# EAGLE board hdmi (EAGLE 6.5.0)
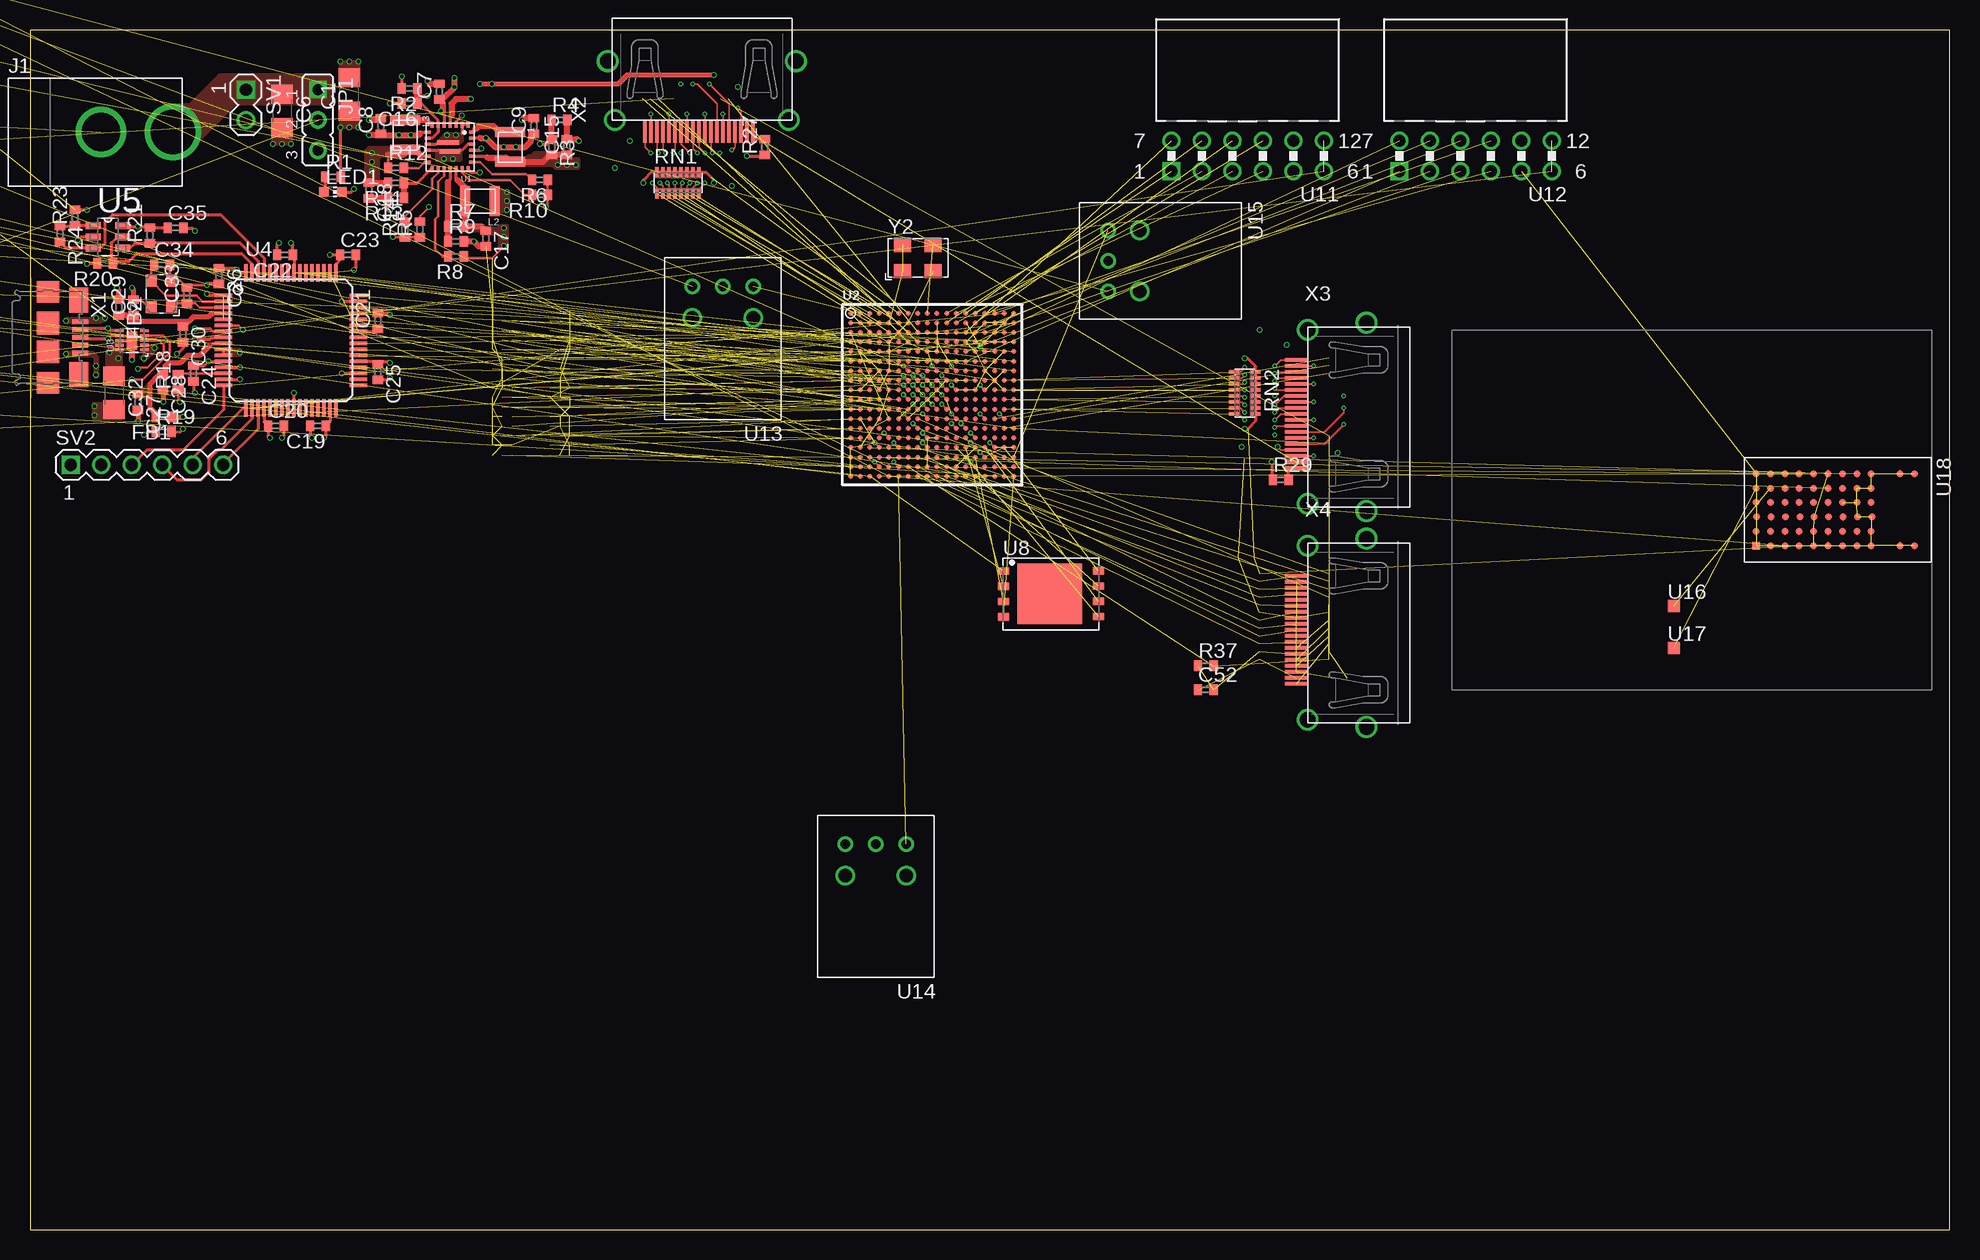
[diagram p9: board, top side]
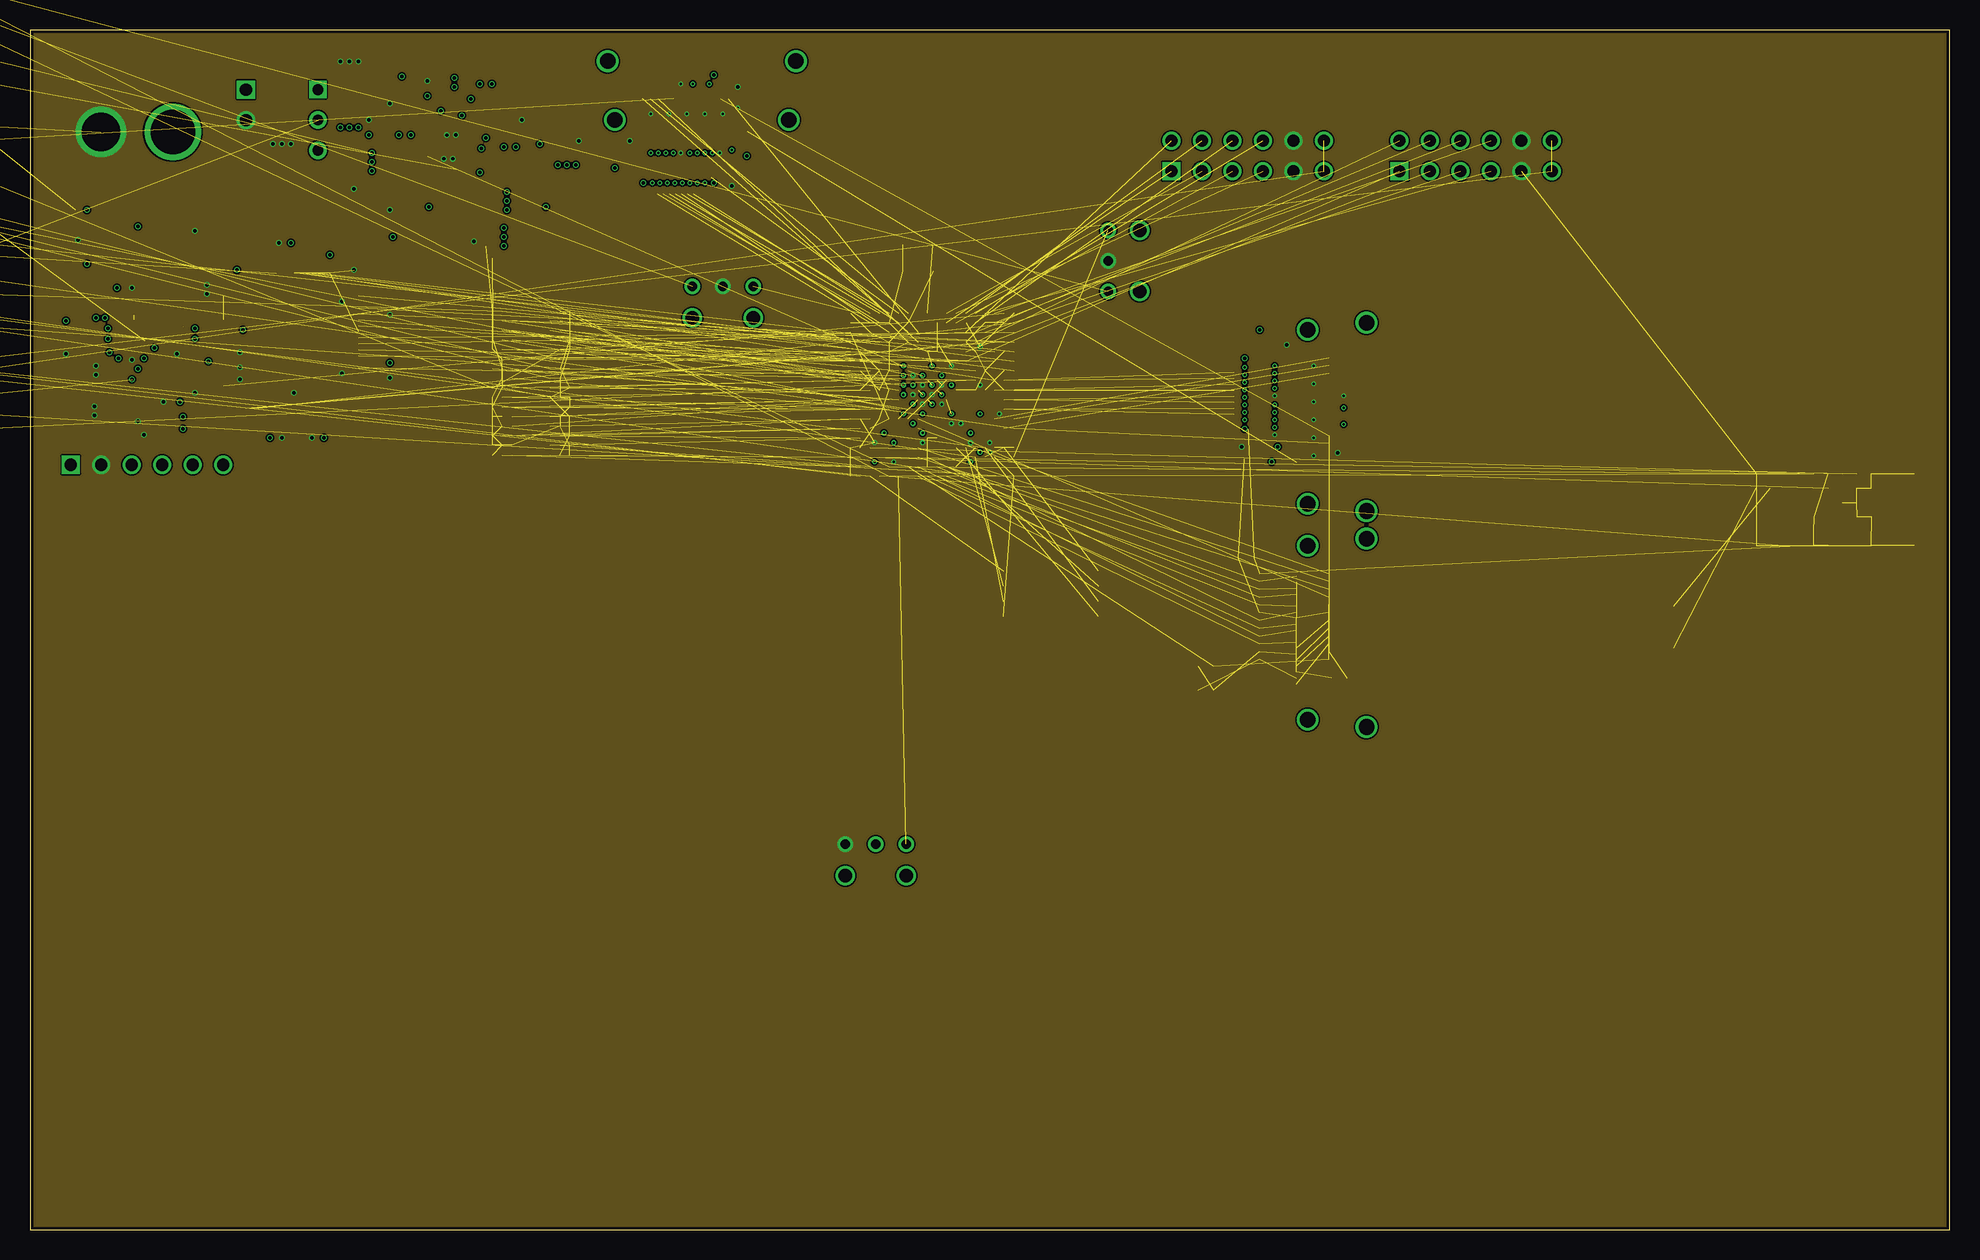
[diagram p10: board, inner layer Ground]
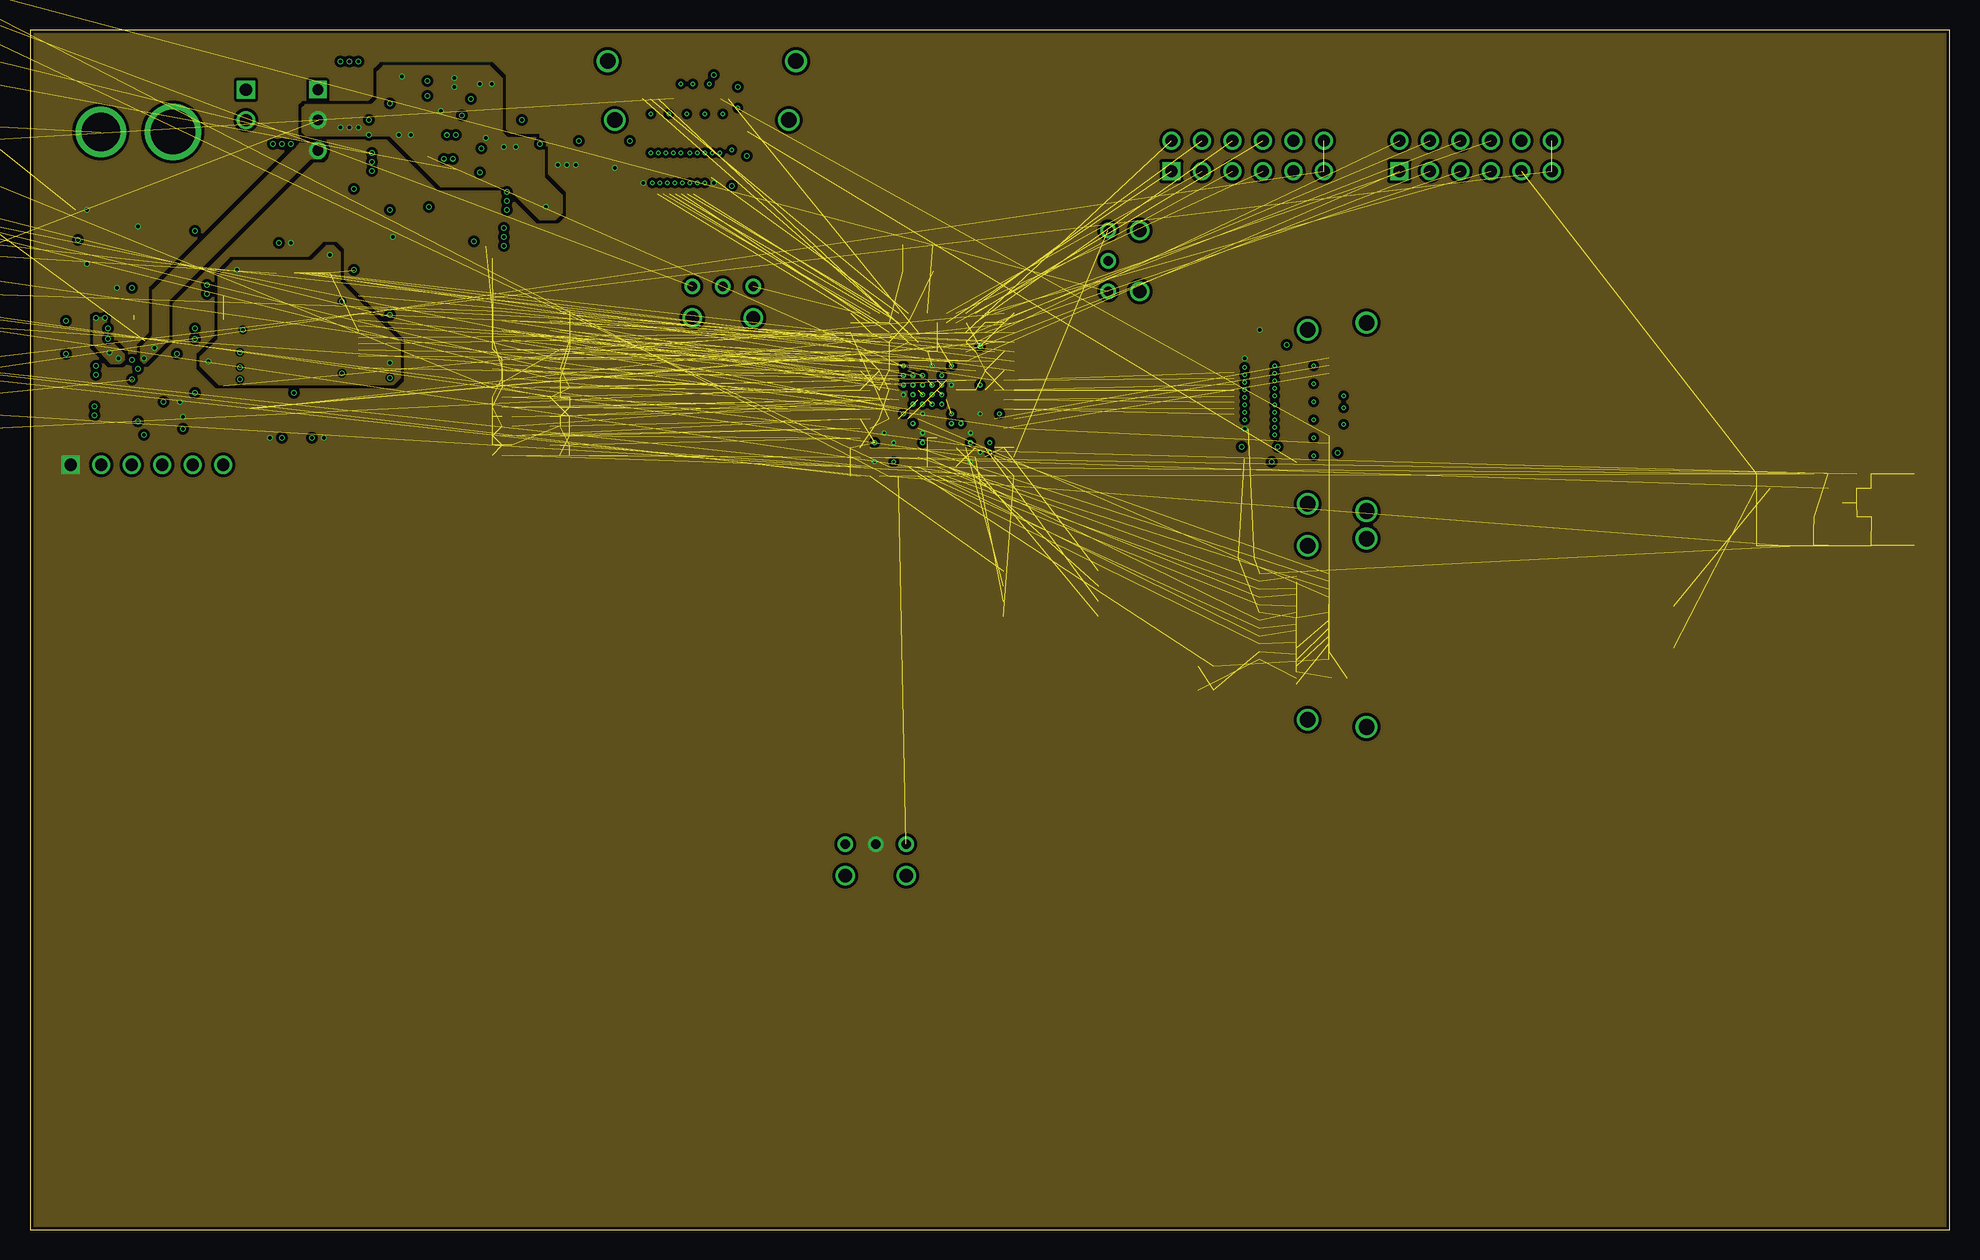
[diagram p11: board, inner layer Power]
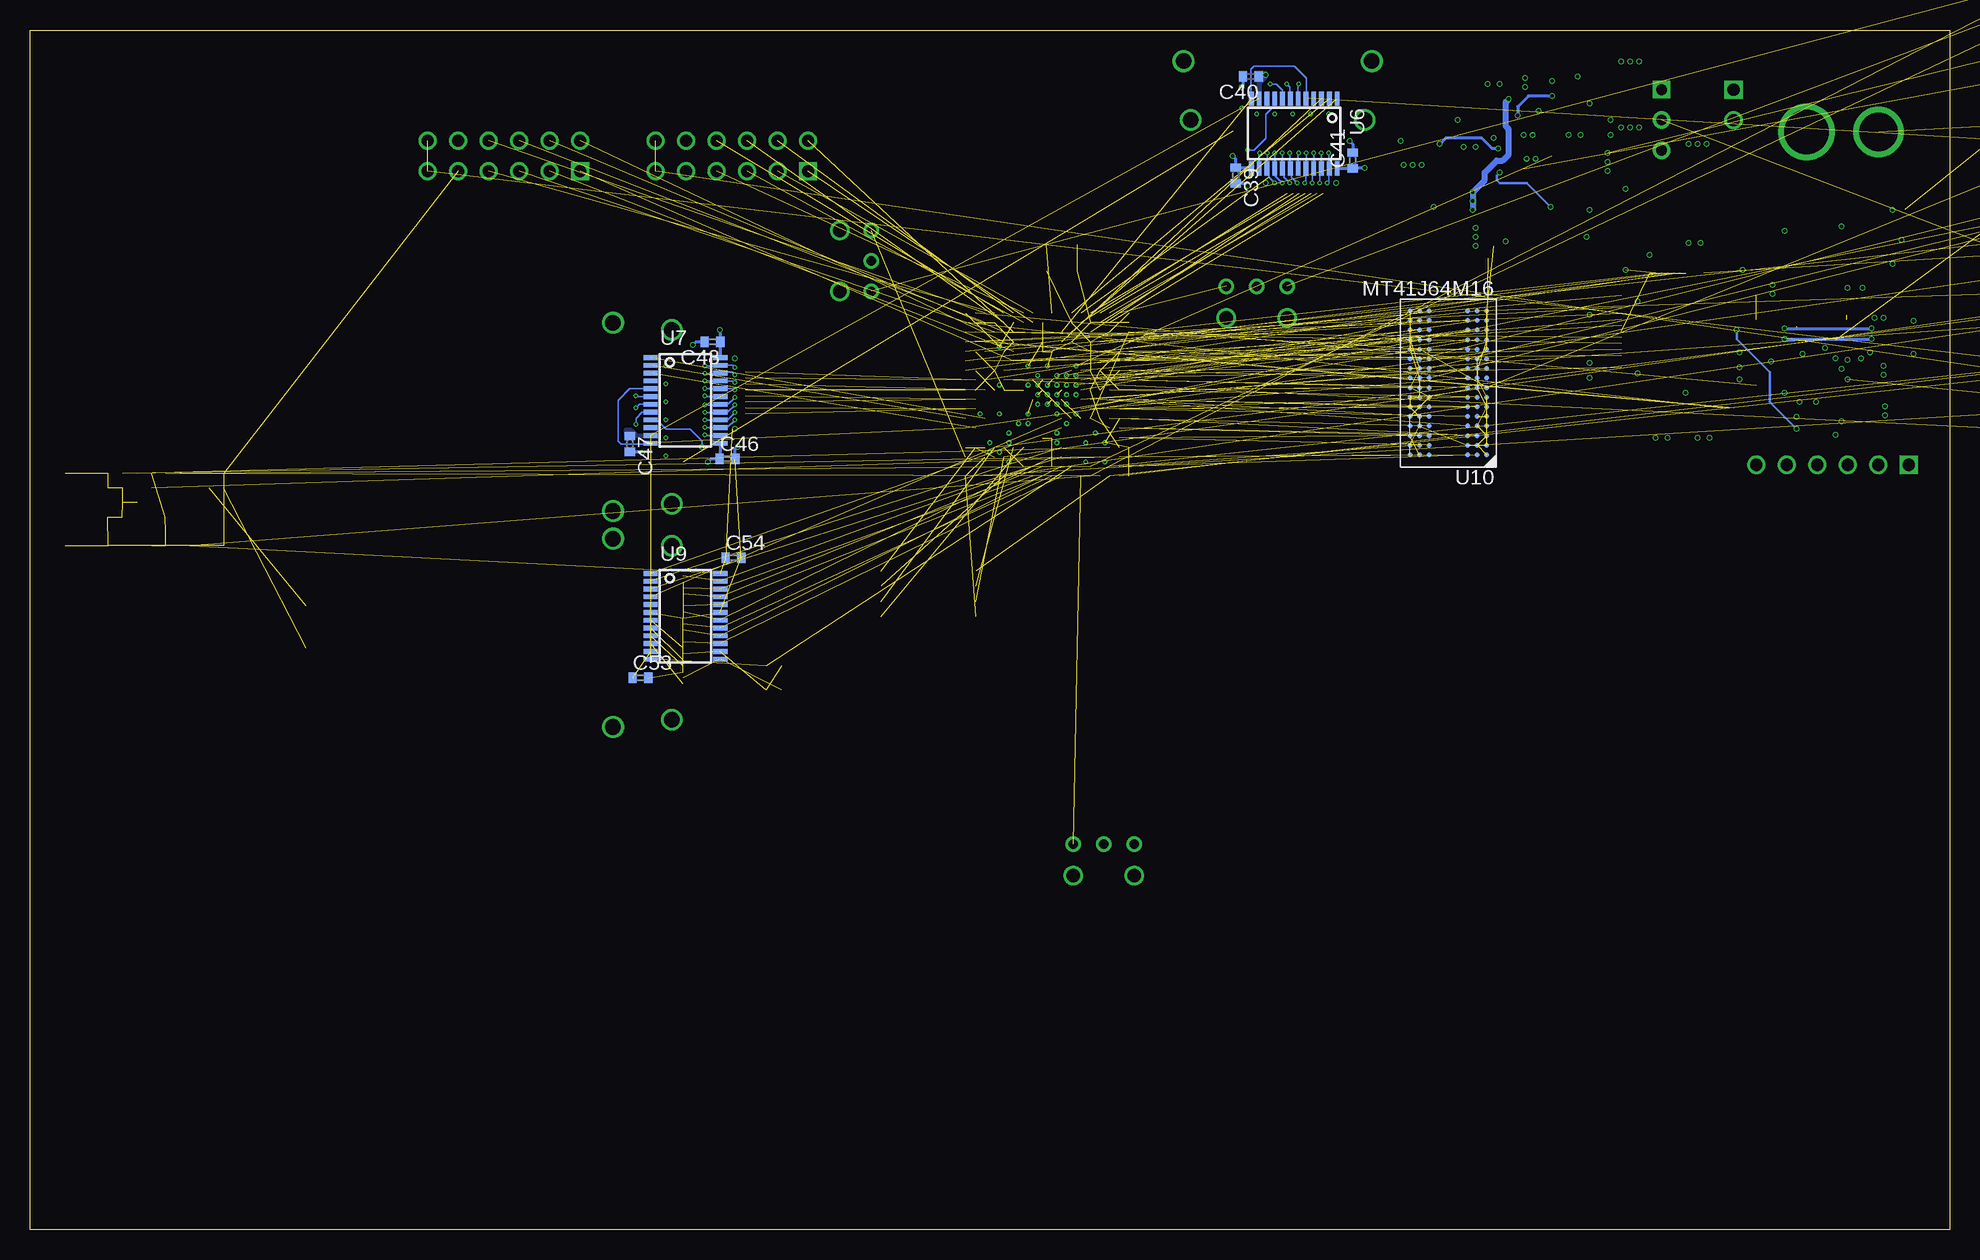
[diagram p12: board, bottom side, seen from below]

Size 160 x 100 mm. Coordinates in mm from the lower left corner, seen from the top.
Outline: 0,0 160,0 160,100 0,100 0,0
Copper layers (1*2+15*16): Top 0.035mm / dielectric 0.2mm / Ground 0.035mm / dielectric 1.5mm / Power 0.035mm / dielectric 0.2mm / Bottom 0.035mm
Design rules "default *": minimum track width 5mil, minimum drill 8mil, track to track 5mil, track to pad 5mil, pad to pad 5mil, via to via 5mil, smd to smd 5mil, copper to edge 10mil, drill to drill 8mil, minimum pad ring 10mil, minimum via ring 4mil, stop-mask expansion 4mil, vias tented up to drill 8mil, thermal gap 10mil
Net classes: 1 power: width 0.127 mm, clearance 0.127 mm; 2 tmds: width 0.127 mm, clearance 0.127 mm; 3 ddr3_vref: width 0.508 mm, clearance 0.254 mm; 4 vbus: width 0.254 mm, clearance 0.127 mm

## Footprints (pad centres in the part's own frame; a part is rotated, then mirrored left to right if it is on the bottom)
1206 = smd 1.6 x 1.8: 1 -1.4,0; 2 1.4,0
0402 = smd 0.7 x 0.9: 1 -0.65,0; 2 0.65,0
PJ-037A = drill 3.2: BARREL 0,0 | drill 3.7: CENTER 6,0
JP2 = drill 0.914 square: 1 -2.54,0 | drill 0.914: 2 0,0; 3 2.54,0
1008 = smd 0.85 x 2.5: 1 -1.225,0; 2 1.225,0
0603 = smd 1.1 x 1: 1 -0.85,0; 2 0.85,0
LED-0603 = smd 0.8 x 0.8: A 0,-0.75; C 0,0.75
MNR18 = smd 0.3 x 0.8: 1 -1.75,-0.9; 2 -1.25,-0.9; 3 -0.75,-0.9; 4 -0.25,-0.9; 5 0.25,-0.9; 6 0.75,-0.9; 7 1.25,-0.9; 8 1.75,-0.9; 9 1.75,0.9; 10 1.25,0.9; 11 0.75,0.9; 12 0.25,0.9; 13 -0.25,0.9; 14 -0.75,0.9; 15 -1.25,0.9; 16 -1.75,0.9
MA02-1 = drill 1.016 square: 1 -1.27,0 | drill 1.016: 2 1.27,0
MA06-1 = drill 1.016 square: 1 -6.35,0 | drill 1.016: 2 -3.81,0; 3 -1.27,0; 4 1.27,0; 5 3.81,0; 6 6.35,0
QFN-26-4X4 = smd 0.25 x 0.5: 1 -1.5,-1.85; 2 -1,-1.85; 3 -0.5,-1.85; 4 0,-1.85; 5 0.5,-1.85; 6 1,-1.85; 7 1.5,-1.85; 14 1.5,1.85; 15 1,1.85; 16 0.5,1.85; 17 0,1.85; 18 -0.5,1.85; 19 -1,1.85; 20 -1.5,1.85 | smd 0.5 x 0.25: 8 1.85,-1.25; 9 1.85,-0.75; 10 1.85,-0.25; 11 1.85,0.25; 12 1.85,0.75; 13 1.85,1.25; 21 -1.85,1.25; 22 -1.85,0.75; 23 -1.85,0.25; 24 -1.85,-0.25; 25 -1.85,-0.75; 26 -1.85,-1.25 | smd 1.8 x 0.4: PGND 0.15,-0.37 | smd 1.67 x 0.38: SGND 0,0.36
CS324 = smd 0.4 x 0.4: A1 -6.8,6.8; A2 -6,6.8; A3 -5.2,6.8; A4 -4.4,6.8; A5 -3.6,6.8; A6 -2.8,6.8; A7 -2,6.8; A8 -1.2,6.8; A9 -0.4,6.8; A10 0.4,6.8; A11 1.2,6.8; A12 2,6.8; A13 2.8,6.8; A14 3.6,6.8; A15 4.4,6.8; A16 5.2,6.8; A17 6,6.8; A18 6.8,6.8; B1 -6.8,6; B2 -6,6; B3 -5.2,6; B4 -4.4,6; B5 -3.6,6; B6 -2.8,6; B7 -2,6; B8 -1.2,6; B9 -0.4,6; B10 0.4,6; B11 1.2,6; B12 2,6; B13 2.8,6; B14 3.6,6; B15 4.4,6; B16 5.2,6; B17 6,6; B18 6.8,6; C1 -6.8,5.2; C2 -6,5.2; C3 -5.2,5.2; C4 -4.4,5.2; C5 -3.6,5.2; C6 -2.8,5.2; C7 -2,5.2; C8 -1.2,5.2; C9 -0.4,5.2; C10 0.4,5.2; C11 1.2,5.2; C12 2,5.2; C13 2.8,5.2; C14 3.6,5.2; C15 4.4,5.2; C16 5.2,5.2; C17 6,5.2; C18 6.8,5.2; D1 -6.8,4.4; D2 -6,4.4; D3 -5.2,4.4; D4 -4.4,4.4; D5 -3.6,4.4; D6 -2.8,4.4; D7 -2,4.4; D8 -1.2,4.4; D9 -0.4,4.4; D10 0.4,4.4; D11 1.2,4.4; D12 2,4.4; D13 2.8,4.4; D14 3.6,4.4; D15 4.4,4.4; D16 5.2,4.4; D17 6,4.4; D18 6.8,4.4; E1 -6.8,3.6; E2 -6,3.6; E3 -5.2,3.6; E4 -4.4,3.6; E5 -3.6,3.6; E6 -2.8,3.6; E7 -2,3.6; E8 -1.2,3.6; E9 -0.4,3.6; E10 0.4,3.6; E11 1.2,3.6; E12 2,3.6; E13 2.8,3.6; E14 3.6,3.6; E15 4.4,3.6; E16 5.2,3.6; E17 6,3.6; E18 6.8,3.6; F1 -6.8,2.8; F2 -6,2.8; F3 -5.2,2.8; F4 -4.4,2.8; F5 -3.6,2.8; F6 -2.8,2.8; F7 -2,2.8; F8 -1.2,2.8; F9 -0.4,2.8; F10 0.4,2.8; F11 1.2,2.8; F12 2,2.8; F13 2.8,2.8; F14 3.6,2.8; F15 4.4,2.8; F16 5.2,2.8; F17 6,2.8; F18 6.8,2.8; G1 -6.8,2; G2 -6,2; G3 -5.2,2; G4 -4.4,2; G5 -3.6,2; G6 -2.8,2; G7 -2,2; G8 -1.2,2; G9 -0.4,2; G10 0.4,2; G11 1.2,2; G12 2,2; G13 2.8,2; G14 3.6,2; G15 4.4,2; G16 5.2,2; G17 6,2; G18 6.8,2; H1 -6.8,1.2; H2 -6,1.2; H3 -5.2,1.2; H4 -4.4,1.2; H5 -3.6,1.2; H6 -2.8,1.2; H7 -2,1.2; H8 -1.2,1.2; H9 -0.4,1.2; H10 0.4,1.2; H11 1.2,1.2; H12 2,1.2; H13 2.8,1.2; H14 3.6,1.2; H15 4.4,1.2; H16 5.2,1.2; H17 6,1.2; H18 6.8,1.2; J1 -6.8,0.4; J2 -6,0.4; J3 -5.2,0.4; J4 -4.4,0.4; J5 -3.6,0.4; J6 -2.8,0.4; J7 -2,0.4; J8 -1.2,0.4; J9 -0.4,0.4; J10 0.4,0.4; J11 1.2,0.4; J12 2,0.4; J13 2.8,0.4; J14 3.6,0.4; J15 4.4,0.4; J16 5.2,0.4; J17 6,0.4; J18 6.8,0.4; K1 -6.8,-0.4; K2 -6,-0.4; K3 -5.2,-0.4; K4 -4.4,-0.4; K5 -3.6,-0.4; K6 -2.8,-0.4; K7 -2,-0.4; K8 -1.2,-0.4; K9 -0.4,-0.4; K10 0.4,-0.4; K11 1.2,-0.4; K12 2,-0.4; K13 2.8,-0.4; K14 3.6,-0.4; K15 4.4,-0.4; K16 5.2,-0.4; K17 6,-0.4; K18 6.8,-0.4; L1 -6.8,-1.2; L2 -6,-1.2; L3 -5.2,-1.2; L4 -4.4,-1.2; L5 -3.6,-1.2; L6 -2.8,-1.2; L7 -2,-1.2; L8 -1.2,-1.2; L9 -0.4,-1.2; L10 0.4,-1.2; L11 1.2,-1.2; L12 2,-1.2; L13 2.8,-1.2; L14 3.6,-1.2; L15 4.4,-1.2; L16 5.2,-1.2; L17 6,-1.2; L18 6.8,-1.2; M1 -6.8,-2; M2 -6,-2; M3 -5.2,-2; M4 -4.4,-2; M5 -3.6,-2; M6 -2.8,-2; M7 -2,-2; M8 -1.2,-2; M9 -0.4,-2; M10 0.4,-2; M11 1.2,-2; M12 2,-2; M13 2.8,-2; M14 3.6,-2; M15 4.4,-2; M16 5.2,-2; M17 6,-2; M18 6.8,-2; N1 -6.8,-2.8; N2 -6,-2.8; N3 -5.2,-2.8; N4 -4.4,-2.8; N5 -3.6,-2.8; N6 -2.8,-2.8; N7 -2,-2.8; N8 -1.2,-2.8; N9 -0.4,-2.8; N10 0.4,-2.8; N11 1.2,-2.8; N12 2,-2.8; N13 2.8,-2.8; N14 3.6,-2.8; N15 4.4,-2.8; N16 5.2,-2.8; N17 6,-2.8; N18 6.8,-2.8; P1 -6.8,-3.6; P2 -6,-3.6; P3 -5.2,-3.6; P4 -4.4,-3.6; P5 -3.6,-3.6; P6 -2.8,-3.6; P7 -2,-3.6; P8 -1.2,-3.6; P9 -0.4,-3.6; P10 0.4,-3.6; P11 1.2,-3.6; P12 2,-3.6; P13 2.8,-3.6; P14 3.6,-3.6; P15 4.4,-3.6; P16 5.2,-3.6; P17 6,-3.6; P18 6.8,-3.6; R1 -6.8,-4.4; R2 -6,-4.4; R3 -5.2,-4.4; R4 -4.4,-4.4; R5 -3.6,-4.4; R6 -2.8,-4.4; R7 -2,-4.4; R8 -1.2,-4.4; R9 -0.4,-4.4; R10 0.4,-4.4; R11 1.2,-4.4; R12 2,-4.4; R13 2.8,-4.4; R14 3.6,-4.4; R15 4.4,-4.4; R16 5.2,-4.4; R17 6,-4.4; R18 6.8,-4.4; T1 -6.8,-5.2; T2 -6,-5.2; T3 -5.2,-5.2; T4 -4.4,-5.2; T5 -3.6,-5.2; T6 -2.8,-5.2; T7 -2,-5.2; T8 -1.2,-5.2; T9 -0.4,-5.2; T10 0.4,-5.2; T11 1.2,-5.2; T12 2,-5.2; T13 2.8,-5.2; T14 3.6,-5.2; T15 4.4,-5.2; T16 5.2,-5.2; T17 6,-5.2; T18 6.8,-5.2; U1 -6.8,-6; U2 -6,-6; U3 -5.2,-6; U4 -4.4,-6; U5 -3.6,-6; U6 -2.8,-6; U7 -2,-6; U8 -1.2,-6; U9 -0.4,-6; U10 0.4,-6; U11 1.2,-6; U12 2,-6; U13 2.8,-6; U14 3.6,-6; U15 4.4,-6; U16 5.2,-6; U17 6,-6; U18 6.8,-6; V1 -6.8,-6.8; V2 -6,-6.8; V3 -5.2,-6.8; V4 -4.4,-6.8; V5 -3.6,-6.8; V6 -2.8,-6.8; V7 -2,-6.8; V8 -1.2,-6.8; V9 -0.4,-6.8; V10 0.4,-6.8; V11 1.2,-6.8; V12 2,-6.8; V13 2.8,-6.8; V14 3.6,-6.8; V15 4.4,-6.8; V16 5.2,-6.8; V17 6,-6.8; V18 6.8,-6.8
SON10 = smd 0.23 x 0.7: 1 -0.8,-1.05; 2 -0.4,-1.05; 3 0,-1.05; 4 0.4,-1.05; 5 0.8,-1.05; 6 0.8,1.05; 7 0.4,1.05; 8 0,1.05; 9 -0.4,1.05; 10 -0.8,1.05 | smd 1.5 x 0.9: ETP 0,0
LQFP64 = smd 1.45 x 0.27: 1 -5.625,3.75; 2 -5.625,3.25; 3 -5.625,2.75; 4 -5.625,2.25; 5 -5.625,1.75; 6 -5.625,1.25; 7 -5.625,0.75; 8 -5.625,0.25; 9 -5.625,-0.25; 10 -5.625,-0.75; 11 -5.625,-1.25; 12 -5.625,-1.75; 13 -5.625,-2.25; 14 -5.625,-2.75; 15 -5.625,-3.25; 16 -5.625,-3.75; 33 5.625,-3.75; 34 5.625,-3.25; 35 5.625,-2.75; 36 5.625,-2.25; 37 5.625,-1.75; 38 5.625,-1.25; 39 5.625,-0.75; 40 5.625,-0.25; 41 5.625,0.25; 42 5.625,0.75; 43 5.625,1.25; 44 5.625,1.75; 45 5.625,2.25; 46 5.625,2.75; 47 5.625,3.25; 48 5.625,3.75 | smd 0.27 x 1.45: 17 -3.75,-5.625; 18 -3.25,-5.625; 19 -2.75,-5.625; 20 -2.25,-5.625; 21 -1.75,-5.625; 22 -1.25,-5.625; 23 -0.75,-5.625; 24 -0.25,-5.625; 25 0.25,-5.625; 26 0.75,-5.625; 27 1.25,-5.625; 28 1.75,-5.625; 29 2.25,-5.625; 30 2.75,-5.625; 31 3.25,-5.625; 32 3.75,-5.625; 49 3.75,5.625; 50 3.25,5.625; 51 2.75,5.625; 52 2.25,5.625; 53 1.75,5.625; 54 1.25,5.625; 55 0.75,5.625; 56 0.25,5.625; 57 -0.25,5.625; 58 -0.75,5.625; 59 -1.25,5.625; 60 -1.75,5.625; 61 -2.25,5.625; 62 -2.75,5.625; 63 -3.25,5.625; 64 -3.75,5.625
SOT23-6 = smd 1.27 x 0.559: 1 -1.219,0.94; 2 -1.219,0; 3 -1.219,-0.94; 4 1.219,-0.94; 5 1.219,0; 6 1.219,0.94
PW_R-PDSO-G24 = smd 1.2 x 0.4: 1 -2.9,3.575; 2 -2.9,2.925; 3 -2.9,2.275; 4 -2.9,1.625; 5 -2.9,0.975; 6 -2.9,0.325; 7 -2.9,-0.325; 8 -2.9,-0.975; 9 -2.9,-1.625; 10 -2.9,-2.275; 11 -2.9,-2.925; 12 -2.9,-3.575; 13 2.9,-3.575; 14 2.9,-2.925; 15 2.9,-2.275; 16 2.9,-1.625; 17 2.9,-0.975; 18 2.9,-0.325; 19 2.9,0.325; 20 2.9,0.975; 21 2.9,1.625; 22 2.9,2.275; 23 2.9,2.925; 24 2.9,3.575
V-PDFN-8_8X6 = smd 0.9 x 0.6: 1 -3.85,1.9; 2 -3.85,0.63; 3 -3.85,-0.64; 4 -3.85,-1.91; 5 4.05,-1.9; 6 4.05,-0.63; 7 4.05,0.64; 8 4.05,1.91 | smd 5.41 x 5.05: ETP 0,0
FBGA96-JT = smd 0.4 x 0.4: A1 -3.2,6.4; A2 -2.4,6.4; A3 -1.6,6.4; A7 1.6,6.4; A8 2.4,6.4; A9 3.2,6.4; B1 -3.2,5.6; B2 -2.4,5.6; B3 -1.6,5.6; B7 1.6,5.6; B8 2.4,5.6; B9 3.2,5.6; C1 -3.2,4.8; C2 -2.4,4.8; C3 -1.6,4.8; C7 1.6,4.8; C8 2.4,4.8; C9 3.2,4.8; D1 -3.2,4; D2 -2.4,4; D3 -1.6,4; D7 1.6,4; D8 2.4,4; D9 3.2,4; E1 -3.2,3.2; E2 -2.4,3.2; E3 -1.6,3.2; E7 1.6,3.2; E8 2.4,3.2; E9 3.2,3.2; F1 -3.2,2.4; F2 -2.4,2.4; F3 -1.6,2.4; F7 1.6,2.4; F8 2.4,2.4; F9 3.2,2.4; G1 -3.2,1.6; G2 -2.4,1.6; G3 -1.6,1.6; G7 1.6,1.6; G8 2.4,1.6; G9 3.2,1.6; H1 -3.2,0.8; H2 -2.4,0.8; H3 -1.6,0.8; H7 1.6,0.8; H8 2.4,0.8; H9 3.2,0.8; J1 -3.2,0; J2 -2.4,0; J3 -1.6,0; J7 1.6,0; J8 2.4,0; J9 3.2,0; K1 -3.2,-0.8; K2 -2.4,-0.8; K3 -1.6,-0.8; K7 1.6,-0.8; K8 2.4,-0.8; K9 3.2,-0.8; L1 -3.2,-1.6; L2 -2.4,-1.6; L3 -1.6,-1.6; L7 1.6,-1.6; L8 2.4,-1.6; L9 3.2,-1.6; M1 -3.2,-2.4; M2 -2.4,-2.4; M3 -1.6,-2.4; M7 1.6,-2.4; M8 2.4,-2.4; M9 3.2,-2.4; N1 -3.2,-3.2; N2 -2.4,-3.2; N3 -1.6,-3.2; N7 1.6,-3.2; N8 2.4,-3.2; N9 3.2,-3.2; P1 -3.2,-4; P2 -2.4,-4; P3 -1.6,-4; P7 1.6,-4; P8 2.4,-4; P9 3.2,-4; R1 -3.2,-4.8; R2 -2.4,-4.8; R3 -1.6,-4.8; R7 1.6,-4.8; R8 2.4,-4.8; R9 3.2,-4.8; T1 -3.2,-5.6; T2 -2.4,-5.6; T3 -1.6,-5.6; T7 1.6,-5.6; T8 2.4,-5.6; T9 3.2,-5.6
PMOD-2X6 = drill 1.016 square: 1 6.35,1.27 | drill 1.016: 2 3.81,1.27; 3 1.27,1.27; 4 -1.27,1.27; 5 -3.81,1.27; 6 -6.35,1.27; 7 6.35,-1.27; 8 3.81,-1.27; 9 1.27,-1.27; 10 -1.27,-1.27; 11 -3.81,-1.27; 12 -6.35,-1.27
PLR135-T10_PLT133-T10W = drill 0.8: 1 2.54,-2.63; 2 0,-2.63; 3 -2.54,-2.63 | drill 1.1: P$1 -2.54,0; P$2 2.54,0
TP10SQ = smd 1 x 1: TP 0,0
PAN1322 = smd 0.6 x 0.6: A1 2.995,-6.625; A2 2.995,-5.425; A3 2.995,-4.225; A4 2.995,-3.025; A5 2.995,-1.825; A6 2.995,-0.625; A7 2.995,0.575; A8 2.995,1.775; A9 2.995,2.975; A11 2.995,5.375; A12 2.995,6.575; B1 1.795,-6.625; B2 1.795,-5.425; B3 1.795,-4.225; B4 1.795,-3.025; B5 1.795,-1.825; B6 1.795,-0.625; B7 1.795,0.575; B8 1.795,1.775; B9 1.795,2.975; C1 0.595,-6.575; C2 0.595,-5.375; C3 0.595,-4.175; C4 0.595,-2.975; C5 0.595,-1.775; C6 0.595,-0.575; C7 0.595,0.625; C8 0.595,1.825; C9 0.595,3.025; D1 -0.605,-6.625; D2 -0.605,-5.425; D3 -0.605,-4.225; D4 -0.605,-3.025; D5 -0.605,-1.825; D6 -0.605,-0.625; D7 -0.605,0.575; D8 -0.605,1.775; D9 -0.605,2.975; E1 -1.805,-6.625; E2 -1.805,-5.425; E3 -1.805,-4.225; E4 -1.805,-3.025; E5 -1.805,-1.825; E6 -1.805,-0.625; E7 -1.805,0.575; E8 -1.805,1.775; E9 -1.805,2.975; F1 -3.005,-6.625; F2 -3.005,-5.425; F3 -3.005,-4.225; F4 -3.005,-3.025; F5 -3.005,-1.825; F6 -3.005,-0.625; F7 -3.005,0.575; F8 -3.005,1.775; F9 -3.005,2.975; F11 -3.005,5.375; F12 -3.005,6.575
USB-UB-S = smd 0.4 x 1.35: D+ 0,2.675; D- -0.65,2.675; GND 1.3,2.675; ID 0.65,2.675; VBUS -1.3,2.675 | smd 1.8 x 1.9: SH0 -3.8,0; SH3 3.8,0 | smd 1.9 x 1.9: SH1 -1.2,0; SH2 1.2,0 | smd 2.1 x 1.6: SH4 3.1,2.55; SH5 -3.1,2.55
HDMI_TYPE_A_RECEPTICAL = smd 1.9 x 0.3: 1 -3.95,4.5; 2 -3.95,4; 3 -3.95,3.5; 4 -3.95,3; 5 -3.95,2.5; 6 -3.95,2; 7 -3.95,1.5; 8 -3.95,1; 9 -3.95,0.5; 10 -3.95,0; 11 -3.95,-0.5; 12 -3.95,-1; 13 -3.95,-1.5; 14 -3.95,-2; 15 -3.95,-2.5; 16 -3.95,-3; 17 -3.95,-3.5; 18 -3.95,-4; 19 -3.95,-4.5 | drill 1.3: SHIELD0 -3,7; SHIELD1 1.9,7.6; SHIELD2 -3,-7.5; SHIELD3 1.9,-8.1
403-3.2X2.5 = smd 1 x 0.9: 1 -1.1,-0.8; 2 1.1,-0.8; 3 1.1,0.9; 4 -1.1,0.9
636 = smd 1.4 x 1.2: 1 -1.27,-1.1; 2 1.27,-1.1; 3 1.27,1.1; 4 -1.27,1.1

## Placement (x,y rotation side)
C1  100u  [1206]  26.62,94.62 90 top
C2  100u  [1206]  -97.79,73.66 0 top  (outside the outline)
C3  4.7u  [0402]  -102.87,102.87 0 top  (outside the outline)
C4  0.47u  [0402]  -24.13,102.87 0 top  (outside the outline)
C5  0.47u  [0402]  -30.48,102.87 0 top  (outside the outline)
C6  100u  [1206]  21,93.25 270 top
C7  10u  [0402]  34.12,94.88 90 top
C8  10u  [0402]  29.25,92 90 top
C9  10u  [0402]  42,92 90 top
C10  100u  [1206]  -91.44,73.66 0 top  (outside the outline)
C11  4.7u  [0402]  -97.79,102.87 0 top  (outside the outline)
C12  0.47u  [0402]  -104.14,97.79 0 top  (outside the outline)
C13  0.47u  [0402]  -17.78,102.87 0 top  (outside the outline)
C14  0.47u  [0402]  -36.83,102.87 0 top  (outside the outline)
C15  4.7u  [0402]  44.75,90.25 90 top
C16  4.7u  [0402]  31.62,93.88 180 top
C17  4.7u  [0402]  38,82.62 270 top
C18  4.7u  [0402]  28.25,86.62 270 top
C19  0.1u  [0402]  24,67 180 top
C20  0.1u  [0402]  20.5,67 0 top
C21  0.1u  [0402]  29,75.75 90 top
C22  0.1u  [0402]  21.25,81.25 180 top
C23  4.7u  [0402]  26.5,81.25 0 top
C24  0.1u  [0402]  13.62,71.38 270 top
C25  0.1u  [0402]  29,71.5 270 top
C26  0.1u  [0402]  15.75,79.5 270 top
C27  4.7u  [0402]  9,69 270 top
C28  0.1u  [0402]  11.09,70.63 270 top
C29  4.7u  [0402]  8.62,76.88 90 top
C30  0.1u  [0402]  12.75,74.62 270 top
C31  4.7u  [0402]  -97.79,92.71 0 top  (outside the outline)
C32  100u  [1206]  7,69.75 270 top
C33  27p  [0402]  13.07,77.88 90 top
C34  27p  [0402]  11,80.42 0 top
C35  0.1u  [0402]  12.12,83.5 0 top
C36  4.7u  [0402]  -77.47,102.87 0 top  (outside the outline)
C37  0.47u  [0402]  -66.04,97.79 0 top  (outside the outline)
C38  0.47u  [0402]  -72.39,97.79 0 top  (outside the outline)
C39  0.1u  [0402]  59.5,87.88 270 bottom
C40  0.1u  [0402]  58.25,96.12 180 bottom
C41  0.1u  [0402]  49.75,89.12 90 bottom
C42  0.1u  [0402]  -62.23,107.95 0 top  (outside the outline)
C43  4.7u  [0402]  -82.55,102.87 0 top  (outside the outline)
C44  0.47u  [0402]  -78.74,97.79 0 top  (outside the outline)
C45  0.47u  [0402]  -85.09,97.79 0 top  (outside the outline)
C46  0.1u  [0402]  101.88,64.25 0 bottom
C47  0.1u  [0402]  110,65.5 270 bottom
C48  0.1u  [0402]  103.12,74 180 bottom
C49  4.7u  [0402]  -87.63,102.87 0 top  (outside the outline)
C50  0.47u  [0402]  -91.44,97.79 0 top  (outside the outline)
C51  0.47u  [0402]  -97.79,97.79 0 top  (outside the outline)
C52  0.1u  [0402]  98,45 0 top
C53  0.1u  [0402]  109.12,46 0 bottom
C54  0.1u  [0402]  101.38,56 0 bottom
C55  4.7u  [0402]  -62.23,102.87 0 top  (outside the outline)
C56  0.47u  [0402]  -53.34,97.79 0 top  (outside the outline)
C57  0.47u  [0402]  -59.69,97.79 0 top  (outside the outline)
C58  1u  [0402]  -45.72,113.03 0 top  (outside the outline)
C59  1u  [0402]  -92.71,107.95 0 top  (outside the outline)
C60  0.1u  [0402]  -67.31,102.87 0 top  (outside the outline)
C61  0.1u  [0402]  -72.39,102.87 0 top  (outside the outline)
C62  0.1u  [0402]  -41.91,102.87 0 top  (outside the outline)
C63  0.1u  [0402]  -52.07,102.87 0 top  (outside the outline)
C64  0.1u  [0402]  -57.15,102.87 0 top  (outside the outline)
C65  0.1u  [0402]  -46.99,102.87 0 top  (outside the outline)
C66  0.1u  [0402]  -92.71,102.87 0 top  (outside the outline)
C67  0.1u  [0402]  -87.63,107.95 0 top  (outside the outline)
C68  0.1u  [0402]  -82.55,107.95 0 top  (outside the outline)
C69  0.1u  [0402]  -16.51,113.03 0 top  (outside the outline)
C70  0.1u  [0402]  -21.59,113.03 0 top  (outside the outline)
FB1  1A  [0402]  11.12,67.75 180 top
FB2  1A  [0402]  7.41,76.88 270 top
J1  PJ-037A  [PJ-037A]  5.9,91.5 0 top
JP1  5V_SEL  [JP2]  24,92.5 270 top
JP2  PMOD0-1_VCC_SEL  [JP2]  -50.8,64.77 0 top  (outside the outline)
JP3  PMOD2-3_VCC_SEL  [JP2]  -69.85,64.77 0 top  (outside the outline)
L1  1u, 3A  [1008]  40,90.25 270 top
L2  1u, 3A  [1008]  37.5,85.75 180 top
L3  1u, 3A  [1008]  31.25,91.25 270 top
L4  47u  [0603]  -36.83,113.03 0 top  (outside the outline)
L5  47u  [0603]  -41.91,113.03 0 top  (outside the outline)
LED1  Green  [LED-0603]  25.25,86.5 270 top
LED2  Yellow  [LED-0603]  -67.31,71.12 0 top  (outside the outline)
R1  1k  [0402]  25.25,87.75 0 top
R2  100  [0402]  31.62,95.12 180 top
R3  309k  [0402]  43.5,90.25 270 top
R4  71.5k  [0402]  44.12,92.5 0 top
R5  10k  [0402]  32.5,83.38 90 top
R6  10k  [0402]  42.5,87.5 180 top
R7  316k  [0402]  35.5,83.62 0 top
R8  10k  [0402]  35.5,81.12 180 top
R9  221k  [0402]  35.5,82.38 0 top
R10  10k  [0402]  42.5,86.25 180 top
R11  274k  [0402]  30.5,87.25 180 top
R12  10k  [0402]  30.5,88.5 0 top
R13  294k  [0402]  30.5,86 180 top
R14  10k  [0402]  31.25,83.38 90 top
R15  10k  [0402]  -24.5,67.62 180 top  (outside the outline)
R16  1k  [0402]  -24.5,65.75 180 top  (outside the outline)
R17  10k  [0402]  -16.51,92.71 0 top  (outside the outline)
R18  10k  [0402]  12.37,70.65 90 top
R19  12k  [0402]  11.12,66.5 0 top
R20  10k  [0402]  6.25,80.54 180 top
R21  10k  [0402]  10,82.88 90 top
R22  10k  [0402]  -107.95,87.63 0 top  (outside the outline)
R23  10k  [0402]  3.75,84.38 90 top
R24  2k2  [0402]  2.5,83 270 top
R25  1k  [0402]  -52.07,87.63 0 top  (outside the outline)
R26  10k  [0402]  -57.15,87.63 0 top  (outside the outline)
R27  1k  [0402]  61.25,90.25 90 top
R28  10k  [0402]  -62.23,87.63 0 top  (outside the outline)
R29  1k  [0402]  104.25,62.5 0 top
R30  2.4k  [0402]  -86.36,80.01 0 top  (outside the outline)
R31  10k  [0402]  -87.63,87.63 0 top  (outside the outline)
R32  100  [0402]  -92.71,87.63 0 top  (outside the outline)
R33  10k  [0402]  -82.55,87.63 0 top  (outside the outline)
R34  1k  [0402]  -46.99,87.63 0 top  (outside the outline)
R35  4.7k  [0402]  -76.2,80.01 0 top  (outside the outline)
R36  100  [0402]  -97.79,87.63 0 top  (outside the outline)
R37  10k  [0402]  98,47 0 top
R38  4.7k  [0402]  -81.28,80.01 0 top  (outside the outline)
R39  120  [0402]  -46.99,92.71 0 top  (outside the outline)
R40  4.7k  [0402]  -71.12,80.01 0 top  (outside the outline)
R41  4.7k  [0402]  -66.04,80.01 0 top  (outside the outline)
R42  240  [0402]  -36.83,92.71 0 top  (outside the outline)
R43  100  [0402]  -41.91,92.71 0 top  (outside the outline)
R44  1k  [0402]  -60.96,92.71 0 top  (outside the outline)
R45  1k  [0402]  -64.77,92.71 0 top  (outside the outline)
R46  10k  [0402]  -31.75,113.03 0 top  (outside the outline)
R47  10k  [0402]  -26.67,113.03 0 top  (outside the outline)
RN1  MNR18  [MNR18]  54,87.25 0 top
RN2  MNR18  [MNR18]  101.25,69.75 270 top
SV1  EXT_SUP  [MA02-1]  18,93.75 270 top
SV2  JTAG  [MA06-1]  9.75,63.75 0 top
U1  MIC23451AAAYFL  [QFN-26-4X4]  35,90.25 180 top
U2  6SLX45CSG324  [CS324]  75.2,69.59 0 top
U3  TPD4S014SON  [SON10]  8.5,74.12 90 top
U4  FT2232HL  [LQFP64]  21.75,74.12 0 top
U5  93LC46BT-I/OT  [SOT23-6]  6.5,82.75 0 top
U6  TPD12S016PWR  [PW_R-PDSO-G24]  54.62,91.38 270 bottom
U7  TPD12S016PWR  [PW_R-PDSO-G24]  105.38,69.12 0 bottom
U8  N25Q128AF8  [V-PDFN-8_8X6]  85,53 0 top
U9  TPD12S016PWR  [PW_R-PDSO-G24]  105.38,51.12 0 bottom
U10  MT41J64M16  [FBGA96-JT]  41.77,70.98 180 bottom
U11  PMOD-2X6  [PMOD-2X6]  101.5,89.5 180 top
U12  PMOD-2X6  [PMOD-2X6]  120.5,89.5 180 top
U13  PLR135-T10  [PLR135-T10_PLT133-T10W]  57.75,76 180 top
U14  PLT133-T10W  [PLR135-T10_PLT133-T10W]  70.5,29.5 180 top
U15  PLR135-T10  [PLR135-T10_PLT133-T10W]  92.5,80.75 270 top
U16  TP10SQ  [TP10SQ]  137,52 0 top
U17  TP10SQ  [TP10SQ]  137,48.5 0 top
U18  PAN1322  [PAN1322]  150.5,60 270 top
X1  USBUB-S  [USB-UB-S]  1.5,74.38 270 top
X2  HDMI_RECEPTICAL_A  [HDMI_TYPE_A_RECEPTICAL]  55.75,95.5 90 top
X3  HDMI_RECEPTICAL_A  [HDMI_TYPE_A_RECEPTICAL]  109.5,68 0 top
X4  HDMI_RECEPTICAL_A  [HDMI_TYPE_A_RECEPTICAL]  109.5,50 0 top
Y1  403  [403-3.2X2.5]  11,78 90 top
Y2  20Mhz  [636]  74,81 0 top

## Tracks (layer width: path | path; a pad name or v marks a point on that pad's centre or on a via)
+1V2  (via drill 0.2, 0.25)  (15 unrouted)
  Top 0.127: U2.M7 v72.8,68 | U2.L8 v73.6,68.8 | U2.H11 v76,71.2 | U2.H9 v74.4,71.2 | U2.J10 v75.2,70.4 | U2.J8 v73.6,70.4 | U2.G7 v72.8,72 | U2.L10 v75.2,68.8 | U2.K9 v74.4,69.6 | U2.M12 v76.8,68 | U2.K11 v76,69.6
  Top 0.203: R12.1 29.85,89.62
  Top 0.254: U1.12 32.62,89.5
  Top 0.508: 32.62,89.5 32.12,90 30.27,90 L3.2 31.25,89.75 31.12,89.62 29.85,89.62 | R11.2 28.35,87.25 28.32,87.28 C18.1
  other vias: 28.5,89.75 28.5,89 28.5,88.25
  pour Top (isolate 0.254, no thermals): 28,90 28.25,90.25 31,90.25 31.25,90 31.25,89.75 31,89.5 29.25,89.5 29,89.25 29,87.5 28.75,87.25 28.25,87.25 28,87.5
+1V5  (via drill 0.25)  (33 unrouted)
  Top 0.203: 36.27,81 38.5,81 v39.5,82
  Top 0.254: U1.18 35.5,87.62 35.62,87.5 | R8.1 36.27,81
  Top 0.508: 35.62,87.5 36.27,86.85 L2.2 36.27,83.75 R7.2 37.65,83.62 C17.1
  other vias: 39.5,83.5 39.5,82.75
  pour Top (isolate 0.254, no thermals): 36,83.5 39,83.5 39.25,83.75 39.75,83.75 39.75,81.75 39.12,81.75 39.12,83 37.75,83 37.5,83.25 36,83.25
+1V5_VREF  (10 unrouted)
+1V8  (via drill 0.25)
  Top 0.254: C24.1 14.53,72.03 v14.88,72.38 U4.12 | U4.49 25.5,80.5 25.85,80.85 C23.1 v25,81.25 | C25.1 28.77,72.38 | 28.77,72.38 U4.37 | 28.77,72.38 29.88,72.38 v30,72.25 | C26.1 17.1,80.15 v17.25,80 17.5,79.75 U4.64
  pour Power (no thermals): 25.25,82 25.75,81.5 25.75,79 30.75,74 30.75,71 30.25,70.5 15.75,70.5 14.25,72 14.25,72.75 15.75,74.25 15.75,79.5 17,80.75 23.5,80.75 24.75,82
+3V3  (via drill 0.2, 0.25)  (66 unrouted)
  Top 0.127: U2.U14 v78.4,64 | U2.T15 v79.2,64.8 | U2.P14 v78.4,66.4 | U2.M15 v79.2,68 | U2.M9 v74.4,68 | U2.K7 v72.8,69.6 | U2.R6 v72,65.6 | U2.P5 v71.2,66.4 | U2.U4 v70.4,64 | U2.P9 v74.4,66.4 | U2.J12 v76.8,70.4 | U2.G10 v75.2,72
  Top 0.203: R5.1 R14.1 | 31.23,82.75 v30.25,82.75 | R18.1 12.37,69.14 v12.5,69
  Top 0.254: U1.22 38,89.5 38.12,89.38 | R14.1 31.23,82.75 | U5.6 7.78,83.62 v9,83.62 9.9,83.62 R21.2 11.45,83.53 C35.1 | U4.42 28.77,74.88 C21.1 | U4.56 22,81.15 C22.1 21.9,82.1 v21.75,82.25 | U4.20 19.5,67.35 C20.1 19.85,66.15 v20,66 | U4.31 25,67.35 C19.1 24.65,66.1 24.6,66.1 v24.5,66 | R23.2 4.72,85.03 v4.75,85 | R20.2 4.79,80.54 v4.75,80.5 | v51.12,87.25 51.12,87.5 51.77,88.15 RN1.16 RN1.15 RN1.14 RN1.13 RN1.12 RN1.11 RN1.10 RN1.9 56.35,88.15 57,87.5 v57,87.25 | v101.25,72.62 101.5,72.62 102.15,71.97 RN2.16 RN2.15 RN2.14 RN2.13 RN2.12 RN2.11 RN2.10 RN2.9 102.15,67.4 101.5,66.75 v101.25,66.75
  Top 0.406: FB2.1 7.41,78.28 v7.25,78.5 | FB1.1 v12.75,67.75
  Top 0.508: C15.1 R3.2 43.35,89.6 42.75,89 40.02,89 L1.2 | 39.75,89.28 L1.2 | 38.12,89.38 39.65,89.38 L1.2
  Bottom 0.254: U7.24 C48.1 102.5,74.03 v102.5,75 | v48.75,88.5 49.73,88.5 C41.1 U6.24
  other vias: 45.5,88.75 44.75,88.75 44,88.75
  pour Power (isolate 0.254, rank 4, no thermals): 0,100 160,100 160,0 0,0
  pour Top (isolate 0.254, no thermals): 41.25,88.75 43.5,88.75 43.75,88.5 45.75,88.5 45.75,89.25 45.25,89.25 44.75,89.75 42,89.75 41.75,89.5 41.5,89.5 41.25,89.25
+5V  (via drill 0.25)  (5 unrouted)
  Top 0.203: v43,85.25 43.15,85.4 R10.1 R6.1
  Top 0.254: R2.2 31,95.15 v31,96.12 | U1.8 32.62,91.5 32.5,91.38 | U1.5 34.5,93 v34.25,93.25 | 37.5,91 U1.25 | R1.2 25.9,91.85 v25.88,91.88
  Top 0.406: v57,96.25 49.75,96.25 49,95.5 v38.5,95.5 v37.5,95.5
  Top 0.508: C8.1 29.6,91.25 v30.75,91.25 v31.75,91.25 32.38,91.25 32.5,91.38 | 29.25,91.25 v28.25,91.25 | 34.38,93.12 34.38,93.97 C7.1 34.35,94.22 v35.38,95.25 v35.38,96 | C9.1 41.75,91.1 41.75,90.75 41.25,90.25 38.75,90.25 v38,91 37.5,91
  other vias: 40.5,90.25 39.5,90.25 27.38,91.88 26.62,91.88
  pour Power (isolate 0.254, rank 2, no thermals): 23,93.75 28.5,93.75 29,94.25 29,96.5 29.5,97 38.25,97 39.25,96 39.25,91.5 39.75,91 42.25,91 42.75,90.5 42.75,87.75 44.25,86.25 44.25,84.75 43.75,84.25 42.5,84.25 39.75,87 34.25,87 30,91.25 23,91.25 22.75,91.5 22.75,93.5
  pour Top (no thermals): 25.88,92.62 27.38,92.62 27.38,91.88 25.88,91.88
  pour Bottom (isolate 0.254, no thermals): 57.62,96.5 57,96.5 57,96 57.5,95.5 57.5,94.5 57.62,94.38
  pour Bottom (isolate 0.254, no thermals): 110.38,66.12 110.38,66.75 109.88,66.75 109.38,66.25 108.38,66.25 108.25,66.12
+5V_SUPPLY  (1 unrouted)
BT_CTS  (1 unrouted)
BT_RESET#  (2 unrouted)
BT_RTS  (1 unrouted)
BT_RX  (1 unrouted)
BT_TX  (1 unrouted)
BT_WAKE  (2 unrouted)
CENTER
  pour Top (isolate 0.254, no thermals): 14,90.75 17.12,93.88 25.12,93.88 25.25,94 25.25,96 25,96.25 15.75,96.25 13.25,93.75 11.75,93.75 11.75,93.5 12.75,93.5 14,92.25
DDR3_A0  (via drill 0.2)  (1 unrouted)
  Top 0.127: U2.J7 v72.8,70.4
DDR3_A1  (1 unrouted)
DDR3_A2  (1 unrouted)
DDR3_A3  (1 unrouted)
DDR3_A4  (1 unrouted)
DDR3_A5  (1 unrouted)
DDR3_A6  (1 unrouted)
DDR3_A7  (1 unrouted)
DDR3_A8  (1 unrouted)
DDR3_A9  (1 unrouted)
DDR3_A10  (1 unrouted)
DDR3_A11  (1 unrouted)
DDR3_A12  (1 unrouted)
DDR3_BA0  (1 unrouted)
DDR3_BA1  (1 unrouted)
DDR3_BA2  (1 unrouted)
DDR3_CAS#  (1 unrouted)
DDR3_CK  (2 unrouted)
DDR3_CK#  (2 unrouted)
DDR3_CKE  (via drill 0.2)  (2 unrouted)
  Top 0.127: U2.H7 v72.8,71.2
DDR3_DQ0  (1 unrouted)
DDR3_DQ1  (1 unrouted)
DDR3_DQ2  (1 unrouted)
DDR3_DQ3  (1 unrouted)
DDR3_DQ4  (1 unrouted)
DDR3_DQ5  (1 unrouted)
DDR3_DQ6  (1 unrouted)
DDR3_DQ7  (1 unrouted)
DDR3_DQ8  (1 unrouted)
DDR3_DQ9  (1 unrouted)
DDR3_DQ10  (1 unrouted)
DDR3_DQ11  (1 unrouted)
DDR3_DQ12  (1 unrouted)
DDR3_DQ13  (1 unrouted)
DDR3_DQ14  (1 unrouted)
DDR3_DQ15  (1 unrouted)
DDR3_LDM  (1 unrouted)
DDR3_LDQS  (1 unrouted)
DDR3_LDQS#  (1 unrouted)
DDR3_ODT  (1 unrouted)
DDR3_RAS#  (1 unrouted)
DDR3_RESET#  (2 unrouted)
DDR3_UDM  (1 unrouted)
DDR3_UDQS  (1 unrouted)
DDR3_UDQS#  (1 unrouted)
DDR3_WE#  (1 unrouted)
FPGA_OSC1  (1 unrouted)
GND  (via drill 0.2, 0.25)  (119 unrouted)
  Top 0.127: U2.T16 v80,64.8 | U2.R16 v80,65.6 | U2.R14 v78.4,65.6 | U2.N13 v77.6,67.2 | U2.N12 v76.8,67.2 | U2.M17 v80.8,68 | U2.J15 v79.2,70.4 | U2.G12 v76.8,72 | U2.E15 v79.2,73.6 | U2.J11 v76,70.4 | U2.K8 v73.6,69.6 | U2.L9 v74.4,68.8 | U2.J9 v74.4,70.4 | U2.H8 v73.6,71.2 | U2.R4 v70.4,65.6 | U2.U6 v72,64 | U2.R9 v74.4,65.6 | U2.L11 v76,68.8 | U2.K10 v75.2,69.6 | X2.2 v51.75,93 | X2.5 v53.25,93 | X2.8 v54.75,93 | X2.11 v56.25,93 | X2.14 v57.75,93 | X2.17 59.25,93.25 v59,93.5 | X3.2 v107,72 | X3.5 v107,70.5 | X3.8 v107,69 | X3.11 v107,67.5 | X3.14 v107,66 | X3.17 v107,64.5
  Top 0.203: R19.1 9.75,66.5 v9.5,66.25 | C34.2 11.65,79.25 Y1.2 12.5,79.1 C33.2 13.3,78.75 v14.75,78.75 | Y1.4 9.85,76.9 9.25,77.5 8.65,77.5 C29.2
  Top 0.254: U3.8 U3.ETP | U1.1 U1.2 36,91.38 | U1.24 36.5,90.5 36,90 35.75,90 | 34.73,90.5 U1.PGND | C16.2 v30,93.88 | U5.2 4.25,82.75 v4,82.5 | C24.2 13.62,69.88 v13.75,69.75 | U4.11 U4.10 | C30.2 12.75,73.5 v12.25,73 | U4.15 v17.5,70.88 | U4.13 v17.5,71.88 | U4.25 v22,69.75 | C23.2 27.15,80.15 v27,80 | U4.47 v26,77.38 | 29.15,71 C25.2 29.85,70.85 v30,71 | U4.35 v26,71.38 | U4.1 14.88,77.88 v14.75,78 | C26.2 14.85,78.85 v14.75,78.75 | C21.2 29.85,76.4 v30,76.25 | C22.2 20.6,82.1 v20.75,82.25 | C20.2 21.15,66.15 v21,66 | C19.2 23.35,66.15 v23.5,66 | LED1.C 26.75,86.5 v27,86.75 | U1.11 34,90 | U1.10 33.88,90.5 | C35.2 13.5,83.5 v13.75,83.25
  Top 0.305: 21.5,91.35 C6.2
  Top 0.406: C29.2 8.62,78.38 v8.5,78.5 | C28.2 11.09,69.04 v11.12,69 | C27.2 v9,67.38
  Top 0.508: v45.75,90.75 45.6,90.9 C15.2 44.77,90.92 R4.2 | R9.2 v37,82.38 37.4,81.97 C17.2 | C18.2 28.38,85.97 28.4,86 R13.2 29.85,85.15 v30,85 | C8.2 29.1,92.5 v28.25,92.5 | v33.12,95.75 33.35,95.53 C7.2 | C9.2 41.15,92.65 v41,92.5 | v8.5,72.5 U3.ETP
  Bottom 0.127: U6.6 54.3,95.45 v54.25,95.5 | U6.14 57.55,89.7 v57.5,89.75 | U7.19 103.7,69.45 v103.75,69.5 | U6.19 54.3,89.7 v54.25,89.75 | U7.6 109.45,69.45 v109.5,69.5 | U7.14 103.7,66.2 v103.75,66.25
  Bottom 0.254: v50,90.75 49.75,90.5 C41.2 | C39.2 58.73,87.22 v58.5,87 | C46.2 101.22,65.03 v101,65.25 | C48.2 104.5,74 v104.75,73.75 | C40.2 58.9,95.4 v59,95.25 | C47.2 109.1,64.85 v109,64.75
  other vias: 34.5,89.26 34.75,91.24 20.25,90.5 21,90.5 21.75,90.5 35.25,89.26 5.38,68.62 5.38,67.88 17.5,73.12 25.88,97.38 26.62,97.38 27.38,97.38 35.5,91.25 3,73 5.5,71.25 5.5,72
  pour Ground (no thermals): 0,100 160,100 160,0 0,0
  pour Top (no thermals): 35.88,89.12 33.88,89.12 33.88,90 35.88,90
  pour Top (no thermals): 35.75,90.5 33.75,90.5 34.62,91.38 36,91.38 36,90.75
  pour Top (no thermals): 20.25,91.25 21.75,91.25 21.75,90.5 20.25,90.5
  pour Top (isolate 0.254, no thermals): 5.25,67.62 7.62,67.62 7.62,68.88 5.25,68.88
  pour Top (no thermals): 16.12,73.38 17.5,73.38 17.5,72.88 16.12,72.88
  pour Top (no thermals): 25.88,97.38 27.38,97.38 27.38,96.62 25.88,96.62
  pour Top (no thermals): 3,73.12 3,72.88 5.12,72.88 5.38,72.62 5.38,71.12 5.62,71.12 5.62,72.75 5.25,73.12
HDMI_RX0_5V  (via drill 0.25)
  Top 0.254: v59.75,89.5 60.9,89.5 R27.1
  Bottom 0.254: U6.13 59.2,88.47 C39.1 59.5,89.25 v59.75,89.5
HDMI_RX0_CEC  (via drill 0.2)
  Top 0.127: X2.13 57.25,93.88 55.62,95.5 v55.25,95.5
  Bottom 0.127: v55.25,95.5 55,95.25 55,94.33 U6.7
HDMI_RX0_CEC_3V3  (1 unrouted)
HDMI_RX0_CLK_N  (via drill 0.2)  (1 unrouted)
  Top 0.127: X2.12 56.75,89.88 v56.88,89.75 | RN1.8 55.75,86.75 v56.25,87.25
  Bottom 0.127: v56.88,89.75 56.88,88.5 U6.15 56.75,88.33 56.75,87.75 v56.25,87.25
HDMI_RX0_CLK_P  (via drill 0.2)  (1 unrouted)
  Top 0.127: X2.10 55.75,90.25 v56.25,89.75 | RN1.7 55.25,86.88 v55.62,87.25
  Bottom 0.127: v56.25,89.75 U6.16 56.25,87.88 v55.62,87.25
HDMI_RX0_CTRL_EN  (2 unrouted)
  Bottom 0.127: U6.5 53.62,94.3 53.62,96 54.62,97 58,97 58.25,96.75 58.25,94.33 U6.12
HDMI_RX0_DATA0_N  (via drill 0.2)  (1 unrouted)
  Top 0.127: RN1.6 54.75,87 v55,87.25 | X2.9 55.25,90.12 v55.62,89.75
  Bottom 0.127: v55,87.25 55.5,87.75 55.5,88.38 U6.17 55.62,88.5 v55.62,89.75
HDMI_RX0_DATA0_P  (via drill 0.2)  (1 unrouted)
  Top 0.127: RN1.5 54.25,87.12 v54.38,87.25 | X2.7 54.25,90.5 v55,89.75
  Bottom 0.127: v54.38,87.25 54.88,87.75 54.88,88.4 U6.18 55,88.53 v55,89.75
HDMI_RX0_DATA1_N  (via drill 0.2)  (1 unrouted)
  Top 0.127: X2.6 53.75,89.88 v53.62,89.75 | RN1.4 v53.75,87.25
  Bottom 0.127: v53.62,89.75 53.62,88.5 U6.20 53.65,87.35 v53.75,87.25
HDMI_RX0_DATA1_P  (via drill 0.2)  (1 unrouted)
  Top 0.127: X2.4 52.75,90 v53,89.75 | RN1.3 53.25,87.12 v53.12,87.25
  Bottom 0.127: v53,89.75 U6.21 53.12,88.35 v53.12,87.25
HDMI_RX0_DATA2_N  (via drill 0.2)  (1 unrouted)
  Top 0.127: X2.3 52.25,89.88 v52.38,89.75 | v52.5,87.25 52.75,87 RN1.2
  Bottom 0.127: v52.38,89.75 52.38,88.5 U6.22 52.5,88.33 v52.5,87.25
HDMI_RX0_DATA2_P  (via drill 0.2)  (1 unrouted)
  Top 0.127: X2.1 51.25,90.25 v51.75,89.75 | RN1.1 52.25,86.88 v51.88,87.25
  Bottom 0.127: v51.88,87.25 51.75,87.38 51.75,88.42 U6.23 51.75,88.53 v51.75,89.75
HDMI_RX0_SCL_3V3  (1 unrouted)
HDMI_RX0_SCL_5V  (via drill 0.2)
  Top 0.127: X2.15 58.25,93.88 v56.62,95.5
  Bottom 0.127: v56.62,95.5 56.12,95.5 55.62,95 55.62,94.3 U6.8
HDMI_RX0_SDA_3V3  (1 unrouted)
HDMI_RX0_SDA_5V  (via drill 0.2)
  Top 0.127: X2.16 58.75,90.25 v58.5,90
  Bottom 0.127: v58.5,90 58,90 57,91 57,93 56.25,93.75 U6.9
HDMI_RX1_5V  (via drill 0.25)
  Top 0.254: v103.5,64 103.5,62.6 R29.1
  Bottom 0.254: v103.5,64 103.25,64.25 C46.1 102.47,64.3 U7.13
HDMI_RX1_CEC  (via drill 0.2)
  Top 0.127: v109.5,68.5 109.5,68.12 107.88,66.5 X3.13
  Bottom 0.127: U7.7 109.2,68.8 v109.5,68.5
HDMI_RX1_CEC_3V3  (1 unrouted)
HDMI_RX1_CLK_N  (via drill 0.2)  (1 unrouted)
  Top 0.127: X3.12 103.88,67 v103.75,66.88 | RN2.8 100.75,68 v101.25,67.5
  Bottom 0.127: v103.75,66.88 103.72,66.85 U7.15 101.9,66.85 v101.25,67.5
HDMI_RX1_CLK_P  (via drill 0.2)  (1 unrouted)
  Top 0.127: X3.10 104.25,68 v103.75,67.5 | RN2.7 100.88,68.5 v101.25,68.12
  Bottom 0.127: v103.75,67.5 U7.16 101.88,67.5 v101.25,68.12
HDMI_RX1_CTRL_EN  (2 unrouted)
  Bottom 0.127: U7.5 110.03,70.1 111,69.12 111,65.75 110.75,65.5 108.33,65.5 U7.12
HDMI_RX1_DATA0_N  (via drill 0.2)  (1 unrouted)
  Top 0.127: X3.9 104.12,68.5 v103.75,68.12 | RN2.6 101,69 v101.25,68.75
  Bottom 0.127: v103.75,68.12 102.5,68.12 U7.17 101.85,68.15 v101.25,68.75
HDMI_RX1_DATA0_P  (via drill 0.2)  (1 unrouted)
  Top 0.127: X3.7 104.5,69.5 v103.75,68.75 | RN2.5 101.12,69.5 v101.25,69.38
  Bottom 0.127: v103.75,68.75 102.53,68.75 U7.18 101.83,68.8 v101.25,69.38
HDMI_RX1_DATA1_N  (via drill 0.2)  (1 unrouted)
  Top 0.127: X3.6 103.88,70 v103.75,70.12 | RN2.4 v101.25,70
  Bottom 0.127: v103.75,70.12 102.5,70.12 U7.20 101.35,70.1 v101.25,70
HDMI_RX1_DATA1_P  (via drill 0.2)  (1 unrouted)
  Top 0.127: X3.4 104,71 v103.75,70.75 | RN2.3 101.12,70.5 v101.25,70.62
  Bottom 0.127: v103.75,70.75 U7.21 101.38,70.75 v101.25,70.62
HDMI_RX1_DATA2_N  (via drill 0.2)  (1 unrouted)
  Top 0.127: X3.3 103.88,71.5 v103.75,71.38 | RN2.2 101,71 v101.25,71.25
  Bottom 0.127: v103.75,71.38 102.5,71.38 U7.22 102.58,71.5 101.5,71.5 v101.25,71.25
HDMI_RX1_DATA2_P  (via drill 0.2)  (1 unrouted)
  Top 0.127: X3.1 104.25,72.5 v103.75,72 | RN2.1 100.88,71.5 v101.25,71.88
  Bottom 0.127: 102.55,72.12 U7.23 | v103.75,72 102.53,72 U7.23 | U7.23 101.42,72.05 v101.25,71.88
HDMI_RX1_SCL_3V3  (1 unrouted)
HDMI_RX1_SCL_5V  (via drill 0.2)
  Top 0.127: v109.5,67.12 107.88,65.5 X3.15
  Bottom 0.127: U7.8 108.97,68.15 109.5,67.62 v109.5,67.12
HDMI_RX1_SDA_3V3  (1 unrouted)
HDMI_RX1_SDA_5V  (via drill 0.25)
  Top 0.127: v104,65.25 104.25,65 X3.16
  Bottom 0.127: U7.9 107.75,67.5 107,66.75 105,66.75 104,65.75 v104,65.25
HDMI_TX0_5V  (2 unrouted)
HDMI_TX0_CEC  (1 unrouted)
HDMI_TX0_CEC_3V3  (via drill 0.2)  (1 unrouted)
  Top 0.127: U2.N8 v73.6,67.2
HDMI_TX0_CLK_N  (2 unrouted)
HDMI_TX0_CLK_P  (2 unrouted)
HDMI_TX0_CTRL_EN  (3 unrouted)
HDMI_TX0_DATA0_N  (2 unrouted)
HDMI_TX0_DATA0_P  (2 unrouted)
HDMI_TX0_DATA1_N  (2 unrouted)
HDMI_TX0_DATA1_P  (2 unrouted)
HDMI_TX0_DATA2_N  (2 unrouted)
HDMI_TX0_DATA2_P  (2 unrouted)
HDMI_TX0_HPD_3V3  (1 unrouted)
HDMI_TX0_HPD_5V  (1 unrouted)
HDMI_TX0_SCL_3V3  (1 unrouted)
HDMI_TX0_SCL_5V  (1 unrouted)
HDMI_TX0_SDA_3V3  (1 unrouted)
HDMI_TX0_SDA_5V  (1 unrouted)
M3_RZQ  (1 unrouted)
N$1
  Top 0.203: U4.2 14.38,77.38 13.88,77.88 11.32,77.88 Y1.3 10.1,80.17 C34.1
N$3  (1 unrouted)
N$4  (2 unrouted)
N$5
  Top 0.203: U4.3 14.12,76.88 13.75,77.25 13.1,77.25 C33.1 12.12,77.22 Y1.1
N$6
  Top 0.254: U5.5 7.25,82.75 6.75,82.25 6.75,80.75 | 6.75,80.75 8.25,80.75 8.88,81.38 17.62,81.38 18.5,80.5 U4.63 | 6.75,80.75 6.75,80.69 R20.1
N$7  (via drill 0.25)
  Top 0.254: U3.6 6.7,74.92 v6.5,75.12 4.53,75.12 X1.D- 4.45,75.05 | v13.75,75.12 15,75.12 15.25,74.88 U4.7
  Bottom 0.254: v13.75,75.12 v6.5,75.12
N$8  (via drill 0.25)
  Top 0.254: U3.7 6.78,74.53 v6.5,74.25 4.55,74.25 X1.D+ | v13.75,74.25 15,74.25 15.12,74.38 U4.8
  Bottom 0.254: v13.75,74.25 v6.5,74.25
N$9
  Top 0.254: U5.4 8.31,81.81 8.75,82.25 10.22,82.25 R21.1 17.52,82.22 19,80.75 U4.62
N$10
  Top 0.254: R24.2 3.04,81.81 U5.3 5.81,81.81 6.25,82.25 6.25,84 6.88,84.62 15.88,84.62 19.5,81 U4.61
N$11  (via drill 0.25)
  Top 0.203: R19.2 12.5,66.5 v12.75,66.75 | v17.75,75 17.38,75.38 U4.6
  Bottom 0.203: v12.75,66.75 15,69 15,71.5 17.75,74.25 v17.75,75
N$12
  Top 0.254: R24.1 3.67,83.65 R23.1 3.79,83.69 U5.1
N$13
  Top 0.203: U4.14 12.44,71.38
  Top 0.254: 12.44,71.38 R18.2
N$14
  Top 0.254: 37.12,91.75 37.1,91.75 U1.26
  Top 0.508: 37.12,91.75 37.38,92 38.62,92 39.15,91.47 L1.1
N$15  (via drill 0.25)
  Top 0.254: U1.9 33.5,91 34,91.5 U1.6 34,92.5 32.62,93.88 C16.1 | U1.3 35.5,92.38 v36,92.88 | v33.12,94.5 32.27,94.5
  Top 0.508: C16.1 32.27,94.5 R2.1
  Bottom 0.254: v33.12,94.5 35.12,94.5 36,93.62 v36,92.88
N$16  (via drill 0.25)
  Top 0.254: 35.12,92.88 35,92.75 U1.4
  Top 0.508: v36.75,94.25 35.5,94.25 35.12,93.88 35.12,92.88
  Bottom 0.508: v36.75,94.25 37,94 37,92 36.75,91.75 36.75,89.62 37.25,89.12 37.75,89.12 38.75,88.12 38.75,87.5 v39.75,86.5 v39.75,85
  other vias: 39.75,85.75
  pour Top (no thermals): 39.75,85 38.75,85 38.75,86.5 39.75,86.5
N$17
  Top 0.254: U1.7 33.35,92.25 33.25,92.25
  Top 0.508: 33.25,92.25 33.02,92.47 L3.1
N$18
  Top 0.254: R11.1 32.25,87.25 33.4,88.4 U1.14
  Top 0.508: R11.1 R13.1
N$19  (1 unrouted)
N$20
  Top 0.203: U1.16 34.5,87.88 34,87.38 34,84.5 33.75,84.25 33.75,81.75 34.38,81.12 R8.2
N$21  (via drill 0.25)
  Top 0.254: U1.23 37.5,90 v37.62,90.12 | v42.5,90.5 43.1,90.5 R3.1
  Top 0.508: R3.1 43.48,90.92 R4.1
  Bottom 0.254: v37.62,90.12 38.12,90.12 39,91 42,91 v42.5,90.5
N$22  (via drill 0.25)
  Top 0.203: U1.20 36.77,88.12 v37.5,88.12 | v33.25,85.25 32.5,84.5 R5.2
  Bottom 0.203: v37.5,88.12 37.75,87.88 37.75,87.5 37.5,87.25 35.25,87.25 v33.25,85.25
N$23
  Top 0.254: U1.17 35,87.5 34.85,87.35
  Top 0.508: R9.1 R7.1 34.85,87.35
N$24
  Top 0.203: R10.2 41.25,86.25 40,87.5 36.62,87.5 36,88.12 U1.19
N$25
  Top 0.203: R6.2 41.35,88 38.5,88 37.5,89 U1.21
N$26
  Top 0.203: U1.13 32.88,89 32.38,88.5 R12.2
N$27
  Top 0.203: U1.15 34,88.12 33.5,87.62 33.5,86.75 31.25,84.5 R14.2
N$28  (2 unrouted)
  Top 0.254: 15.12,76.38 U4.4
  Top 0.406: 8.51,75.75 8.5,75.75 8.62,75.88 | 8.51,75.75 13.25,75.75 | 13.25,75.75 13.62,76.12 14.88,76.12 15.12,76.38 15.25,76.38 | 13.25,75.75 12.78,75.28 | 8.51,75.75 8,76.25 7.5,76.25 FB2.2
N$29  (1 unrouted)
N$31
  Top 0.254: 14.88,73.62 15,73.62 15.25,73.88 U4.9
  Top 0.406: FB1.2 10.47,68.03 10,68.5 10,70.5 10.78,71.28 C28.1 11.25,71.44 11.25,72 11.5,72.25 12.5,72.25 13.12,72.88 14.12,72.88 14.88,73.62
  pour Top (no thermals): 9.12,69.75 9.88,70.5 10,70.5 10,68.88
N$33  (1 unrouted)
N$34  (1 unrouted)
N$35  (1 unrouted)
N$36  (2 unrouted)
N$37
  Top 0.254: R29.2 104.9,63.4 105,63.5 X3.19
N$38  (1 unrouted)
N$39  (1 unrouted)
N$40  (1 unrouted)
N$41  (2 unrouted)
N$42  (3 unrouted)
N$43  (1 unrouted)
N$44  (2 unrouted)
N$45  (via drill 0.25)
  Top 0.254: U3.9 U3.10
  other vias: 6.62,73.12 7.38,72.62 5.5,76 6.25,76 3,75.75
  pour Top (isolate 0.254, no thermals): 7.62,73.75 6.88,73.75 6.38,73.25 6.38,71.25 7.62,71.25
  pour Power (isolate 0.254, no thermals): 5.38,76 6.25,76 6.25,74.5 7.75,73 7.75,72.5 7.5,72.25 6.75,72.25 5.38,73.75
  pour Top (no thermals): 3,76 6.25,76 6.25,75.75 6,75.75 5.88,75.62 3,75.62
N$46  (2 unrouted)
N$47
  Top 0.254: R1.1 24.6,86.6 LED1.A
N$49  (2 unrouted)
N$50
  Top 0.254: R27.2 60.35,90.9 60.25,91 X2.19
N$51  (2 unrouted)
PMOD0_0  (1 unrouted)
PMOD0_1  (1 unrouted)
PMOD0_2  (1 unrouted)
PMOD0_3  (1 unrouted)
PMOD1_0  (1 unrouted)
PMOD1_1  (1 unrouted)
PMOD1_2  (1 unrouted)
PMOD1_3  (1 unrouted)
PMOD2_0  (1 unrouted)
PMOD2_1  (1 unrouted)
PMOD2_2  (1 unrouted)
PMOD2_3  (1 unrouted)
PMOD3_0  (1 unrouted)
PMOD3_1  (1 unrouted)
PMOD3_2  (1 unrouted)
PMOD3_3  (1 unrouted)
TOS_IN0  (1 unrouted)
TOS_IN1  (1 unrouted)
TOS_OUT0  (1 unrouted)
USB_5V_ACK#  (via drill 0.25)  (2 unrouted)
  Top 0.203: U3.4 11.1,74.53 11.62,74 11.62,73.12 9.38,70.88 v8.5,70.88
USB_5V_DISABLE  (via drill 0.25)  (1 unrouted)
  Top 0.203: U3.3 10.75,74.12 11.12,73.75 11.12,73.25 9.75,71.88 9.12,71.88 v9,71.75
USB_5V_OFF  (1 unrouted)
USB_BC0  (1 unrouted)
USB_BC1  (1 unrouted)
USB_BC2  (1 unrouted)
USB_BC3  (1 unrouted)
USB_BC4  (1 unrouted)
USB_BD0  (1 unrouted)
USB_BD1  (1 unrouted)
USB_BD2  (1 unrouted)
USB_BD3  (1 unrouted)
USB_BD4  (1 unrouted)
USB_BD5  (1 unrouted)
USB_BD6  (1 unrouted)
USB_BD7  (1 unrouted)
USB_PWRSAVE#  (1 unrouted)
USB_SUSPEND#  (1 unrouted)
USB_TCK  (1 unrouted)
  Top 0.254: U4.16 16.12,68.38 12.75,65 9.73,65 SV2.3
USB_TDI  (1 unrouted)
  Top 0.254: U4.17 17.75,68.5 13.56,64.31 SV2.5
USB_TDO  (1 unrouted)
  Top 0.254: U4.18 18.5,67.62 15.88,65 15.62,65 14.88,64.25 14.88,63.12 14.25,62.5 12.25,62.5 11.02,63.73 SV2.4
USB_TMS  (1 unrouted)
  Top 0.254: U4.19 19,66.75 16.1,63.85 SV2.6
USB_VBUS  (via drill 0.25)
  other vias: 9.5,72.62 10.38,73.5
  pour Top (isolate 0.254, no thermals): 9.5,73.75 10.38,73.75 10.62,73.5 9.5,72.38 9.25,72.62 9.25,72.75 9.5,73
  pour Power (isolate 0.254, rank 3, no thermals): 9.25,72.5 9.5,72.25 11.5,74.25 11.5,77.5 23.38,89.38 24.25,89.38 24.5,89.62 24.5,90.25 24.25,90.5 22.5,90.5 10.25,78.25 10.25,74.5 9.25,73.5